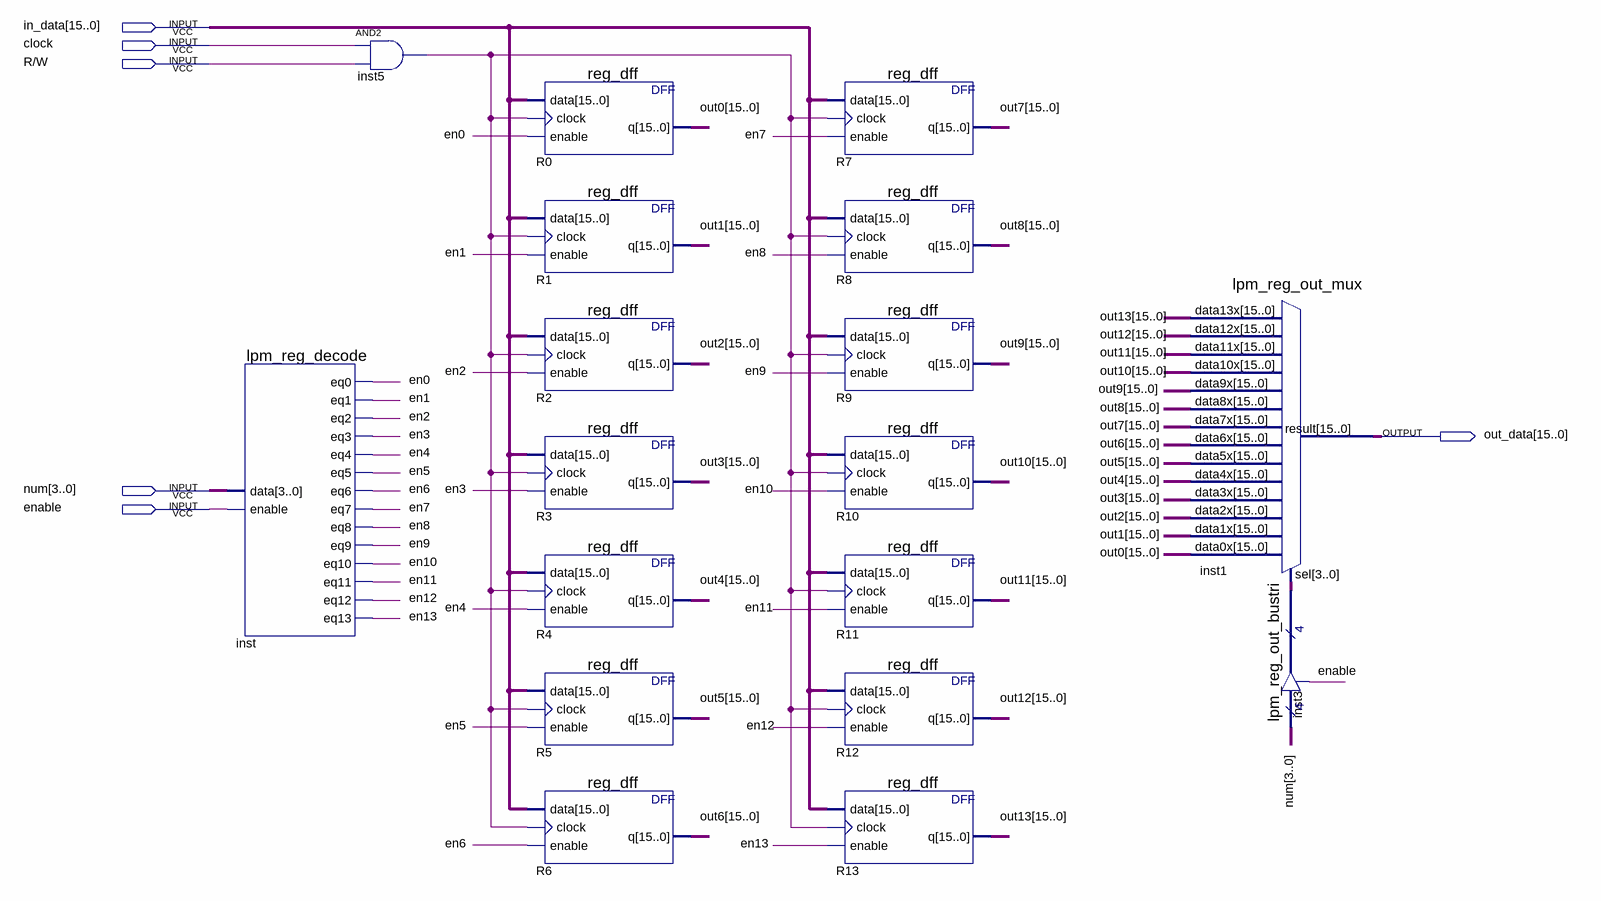
[diagram p0: schematic sheet]
// Quartus schematic Registers.bdf as structural Verilog: 18 symbols, 6 pins
module Registers (
  input  [15:0] in_data,
  input  clock,
  input  \R/W ,
  input  [3:0] num,
  input  enable,
  output [15:0] out_data
);

  wire en0, en1, en2, en3, en4, en5, en6, en7, en8, en9, en10, en11, en12, en13, inst5_out;
  wire [3:0] inst3_tridata;
  wire [15:0] out0, out1, out2, out3, out4, out5, out6, out7, out8, out9, out10, out11, out12, out13;

  lpm_reg_decode inst (
    .data(num), .enable(enable), .eq0(en0), .eq1(en1), .eq2(en2), .eq3(en3), .eq4(en4), .eq5(en5), .eq6(en6),
    .eq7(en7), .eq8(en8), .eq9(en9), .eq10(en10), .eq11(en11), .eq12(en12), .eq13(en13));
  and inst5 (inst5_out, clock, \R/W );
  reg_dff R0 (.data(in_data), .clock(inst5_out), .enable(en0), .q(out0));
  reg_dff R1 (.data(in_data), .clock(inst5_out), .enable(en1), .q(out1));
  reg_dff R2 (.data(in_data), .clock(inst5_out), .enable(en2), .q(out2));
  reg_dff R3 (.data(in_data), .clock(inst5_out), .enable(en3), .q(out3));
  reg_dff R4 (.data(in_data), .clock(inst5_out), .enable(en4), .q(out4));
  reg_dff R5 (.data(in_data), .clock(inst5_out), .enable(en5), .q(out5));
  reg_dff R6 (.data(in_data), .clock(inst5_out), .enable(en6), .q(out6));
  reg_dff R7 (.data(in_data), .clock(inst5_out), .enable(en7), .q(out7));
  reg_dff R8 (.data(in_data), .clock(inst5_out), .enable(en8), .q(out8));
  reg_dff R9 (.data(in_data), .clock(inst5_out), .enable(en9), .q(out9));
  reg_dff R10 (.data(in_data), .clock(inst5_out), .enable(en10), .q(out10));
  reg_dff R11 (.data(in_data), .clock(inst5_out), .enable(en11), .q(out11));
  reg_dff R12 (.data(in_data), .clock(inst5_out), .enable(en12), .q(out12));
  reg_dff R13 (.data(in_data), .clock(inst5_out), .enable(en13), .q(out13));
  lpm_reg_out_mux inst1 (
    .data13x(out13), .data12x(out12), .data11x(out11), .data10x(out10), .data9x(out9), .data8x(out8),
    .data7x(out7), .data6x(out6), .data5x(out5), .data4x(out4), .data3x(out3), .data2x(out2), .data1x(out1),
    .data0x(out0), .sel(inst3_tridata), .result(out_data));
  lpm_reg_out_bustri inst3 (.enabledt(enable), .data(num), .tridata(inst3_tridata));
endmodule
